# EAGLE design mosfet (EAGLE 7.4.0)
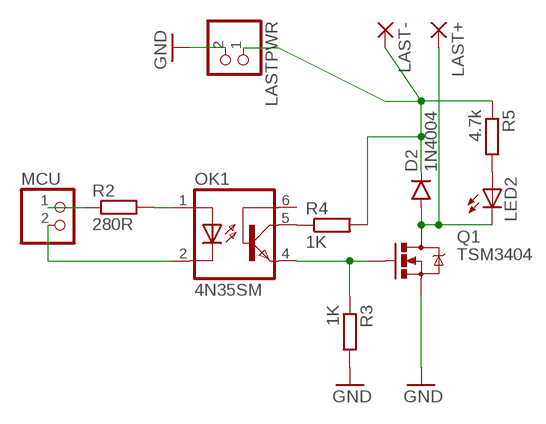
[diagram p0: schematic, sheet 1]

## Parts
D2  1N4004  DIODESOD123  [SOD-123]
LAST+  WIREPADSMD2,54-5,08  [SMD2,54-5,08]
LAST-  WIREPADSMD2,54-5,08  [SMD2,54-5,08]
LASTPWR  PINHD-1X2  [1X02]
LED2  LEDCHIP-LED0805  [CHIP-LED0805]
MCU  PINHD-1X2  [1X02]
OK1  4N35SM  [DIL6-SMD]
Q1  TSM3404  MOSFET-NCHANNELBSS123LT1G  [SOT23-3]
R2  280R  R-EU_R0805  [R0805]
R3  1K  R-EU_R0805  [R0805]
R4  1K  R-EU_R0805  [R0805]
R5  4.7k  R-EU_R0805  [R0805]

## Nets
GND: LASTPWR.2 Q1.2(S) R3.2
LAST+: D2.C LAST-.1(P) LASTPWR.1 R4.2 R5.1
LAST-: D2.A LAST+.1(P) LED2.C Q1.3(D)
N$1: OK1.1(A) R2.2
N$2: MCU.1 R2.1
N$3: MCU.2 OK1.2(C)
N$4: OK1.4(EMI) Q1.1(G) R3.1
N$5: OK1.5(COL) R4.1
N$6: LED2.A R5.2
Unconnected: OK1.6(BAS)

## Library data of the parts
D2 = SparkFun-DiscreteSemi:DIODE: Diode These are standard reverse protection diodes and small signal diodes. SMA package can handle up to about 1A. SOD-323 can handle about 200mA. What the SOD-323 package when ordering, there are some mfgs out there that are 5-pin packages.
LAST+ LAST- = wirepad:WIREPAD: Wire PAD connect wire on PCB
LASTPWR MCU = pinhead:PINHD-1X2: PIN HEADER
LED2 = led:LED: LED OSRAM: - CHIPLED LG R971, LG N971, LY N971, LG Q971, LY Q971, LO R971, LY R971 LH N974, LH R974 LS Q976, LO Q976, LY Q976 LO Q996 - Hyper CHIPLED LW Q18S LB Q993, LB Q99A, LB R99A - SideLED LS A670, LO A670, LY A670, LG A670, LP A670 LB A673, LV A673, LT A673, LW A673 LH A674 LY A675 LS A676, LA A676, LO A676, LY A676, LW A676 LS A679, LY A679, LG A679 - Hyper Micro SIDELED® LS Y876, LA Y876, LO Y876, LY Y876 LT Y87S - SmartLED LW L88C, LW L88S LB L89C, LB L89S, LG L890 LS L89K, LO L89K, LY L89K LS L896, LA L896, LO L896, LY L896 - TOPLED LS T670, LO T670, LY T670, LG T670, LP T670 LSG T670, LSP T670, LSY T670, LOP T670, LYG T670 LG T671, LOG T671, LSG T671 LB T673, LV T673, LT T673, LW T673 LH T674 LS T676, LA T676, LO T676, LY T676, LB T676, LH T676, LSB T676, LW T676 LB T67C, LV T67C, LT T67C, LS T67K, LO T67K, LY T67K, LW E67C LS E67B, LA E67B, LO E67B, LY E67B, LB E67C, LV E67C, LT E67C LW T67C LS T679, LY T679, LG T679 LS T770, LO T770, LY T770, LG T770, LP T770 LB T773, LV T773, LT T773, LW T773 LH T774 LS E675, LA E675, LY E675, LS T675 LS T776, LA T776, LO T776, LY T776, LB T776 LHGB T686 LT T68C, LB T68C - Hyper Mini TOPLED® LB M676 - Mini TOPLED Santana® LG M470 LS M47K, LO M47K, LY M47K Source: http://www.osram.convergy.de LUXEON: - LUMILED® LXK2-PW12-R00, LXK2-PW12-S00, LXK2-PW14-U00, LXK2-PW14-V00 LXK2-PM12-R00, LXK2-PM12-S00, LXK2-PM14-U00 LXK2-PE12-Q00, LXK2-PE12-R00, LXK2-PE12-S00, LXK2-PE14-T00, LXK2-PE14-U00 LXK2-PB12-K00, LXK2-PB12-L00, LXK2-PB12-M00, LXK2-PB14-N00, LXK2-PB14-P00, LXK2-PB14-Q00 LXK2-PR12-L00, LXK2-PR12-M00, LXK2-PR14-Q00, LXK2-PR14-R00 LXK2-PD12-Q00, LXK2-PD12-R00, LXK2-PD12-S00 LXK2-PH12-R00, LXK2-PH12-S00 LXK2-PL12-P00, LXK2-PL12-Q00, LXK2-PL12-R00 Source: www.luxeon.com KINGBRIGHT: KA-3528ASYC Source: www.kingbright.com
OK1 = optocoupler:4N*?M: General Purpose 6-Pin Phototransistor Optocouplers Source: http://www.fairchildsemi.com/ds/4N/4N35-M.pdf; MF: FAIRCHILD SEMICONDUCTOR; MPN: 4N35S-M; OC_FARNELL: 1021179; OC_NEWARK: 67K2285
Q1 = SparkFun-DiscreteSemi:MOSFET-NCHANNEL: Common NMOSFET Parts MFG P/N Store ID Prod ID FDD8780 TRANS-09984 SI7820DN TRANS-11055 FDS6630A IC-08089 2N7002PW TRANS-11151 FQP30N06L COM-10213 TRANS-10060 BSS123LT1G TRANS-08345 BSS138 TRANS-00830 BS170 2N7000; PROD_ID: TRANS-08345
R2-R5 = resistor:R-EU_: RESISTOR, European symbol

## Net classes
0 default: width 0.508 mm

## Board
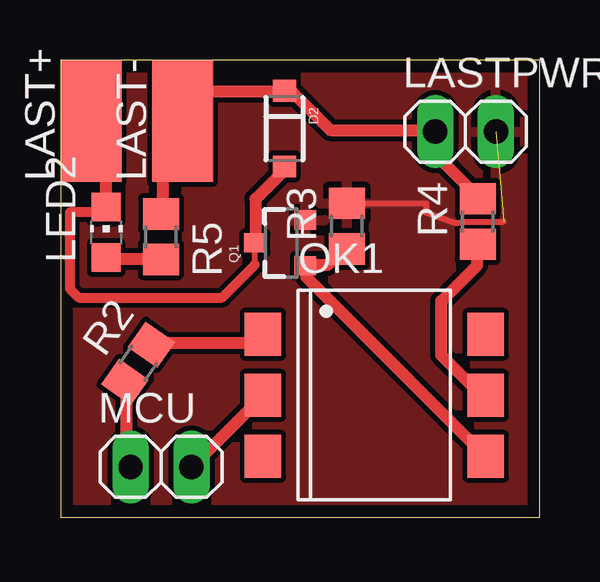
[diagram p1: board, top side]

Size 19.99 x 19.04 mm. Coordinates in mm from the lower left corner, seen from the top.
Outline: 0,0 19.99,0 19.99,19.04 0,19.04 0,0
Copper layers (1*16): Top 0.035mm / dielectric 1.5mm / Bottom 0.035mm
Design rules "default *": minimum track width 10mil, minimum drill 24mil, track to track 8mil, track to pad 8mil, pad to pad 8mil, via to via 8mil, smd to smd 8mil, copper to edge 20mil, drill to drill 8mil, minimum pad ring 10mil, minimum via ring 8mil, stop-mask expansion 4mil, vias tented up to drill 0mil, thermal gap 10mil

### Footprints (pad centres in the part's own frame; a part is rotated, then mirrored left to right if it is on the bottom)
SOD-123 = smd 0.9 x 0.95: A 1.575,0; C -1.575,0
SMD2,54-5,08 = smd 2.54 x 5.08: 1 0,0
1X02 = drill 1.016 long: 1 -1.27,0; 2 1.27,0
CHIP-LED0805 = smd 1.2 x 1.2: A 0,-1.05; C 0,1.05
DIL6-SMD = smd 1.78 x 1.52: 1 -2.54,-4.645; 2 0,-4.645; 3 2.54,-4.645; 4 2.54,4.645; 5 0,4.645; 6 -2.54,4.645
SOT23-3 = smd 0.8 x 0.9: 1 -0.95,-1; 2 0.95,-1; 3 0,1.1
R0805 = smd 1.3 x 1.5: 1 -0.95,0; 2 0.95,0

### Placement (x,y rotation side)
D2  9.33,16.19 270 top
LAST+  1.27,16.51 0 top
LAST-  5.08,16.51 0 top
LASTPWR  16.89,16.07 0 top
LED2  1.91,11.87 0 top
MCU  4.19,2.1 0 top
OK1  13.08,5.08 270 top
Q1  9.21,11.43 90 top
R2  3.24,6.41 54.8 top
R3  11.94,12.13 90 top
R4  17.4,12.32 90 top
R5  4.19,11.68 270 top

### Tracks (layer width: path | path; a pad name or v marks a point on that pad's centre or on a via)
GND  (1 unrouted)
  Top 0.254: R3.2 15.24,13.08 15.24,12.7 16.51,12.26 16.76,12.32 18.48,12.32
  pour Top: 0,0 0,19.05 20.32,19.05 20.32,0
LAST+
  Top 0.508: R4.2 17.38,13.38 15.62,15.12 15.62,16 LASTPWR.1 15.38,16.12 11.25,16.12 9.5,17.88 D2.C 9.25,17.75 6.25,17.75 5.12,16.62 LAST-.1 4.88,16.38 4.25,15.75 4.25,12.75 R5.1
LAST-
  Top 0.254: LED2.C 1.68,12.7 | 8.11,10.52 Q1.3
  Top 0.406: 1.68,12.7 0.38,12.7 0.38,9.53 0.76,9.14 6.73,9.14 8.11,10.52
  Top 0.508: LED2.C 1.88,13 1.88,16 1.38,16.5 LAST+.1 | Q1.3 8.12,11.5 8.12,13.25 9.38,14.5 D2.A
N$1
  Top 0.508: R2.2 3.88,7.25 8.12,7.25 8.38,7.5 OK1.1
N$2
  Top 0.508: R2.1 2.75,5.62 2.75,2.25 2.88,2.12 MCU.1
N$3
  Top 0.508: OK1.2 8.38,5 5.5,2.12 MCU.2
N$4
  Top 0.508: R3.1 11.88,11.25 11.12,10.5 10.25,10.5 Q1.1 10.25,10.25 10.25,10 17.62,2.62 OK1.4
N$5
  Top 0.508: R4.1 17.38,11.25 17.38,10.5 15.88,9 15.88,6.75 17.62,5 OK1.5
N$6
  Top 0.508: LED2.A 2,10.75 4.12,10.75 R5.2